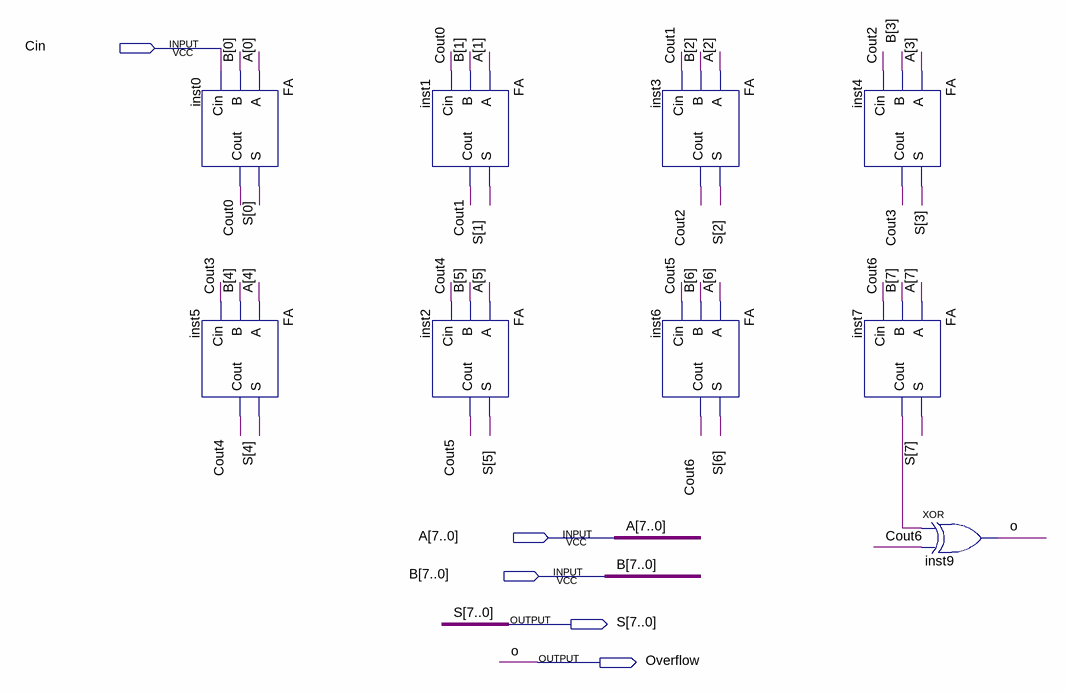
[diagram p0: schematic sheet]
// Quartus schematic Adder8bit.bdf as structural Verilog: 9 symbols, 5 pins
module Adder8bit (
  input  Cin,
  input  [7:0] A,
  input  [7:0] B,
  output [7:0] S,
  output Overflow
);

  wire Cout0, Cout1, Cout2, Cout3, Cout4, Cout5, Cout6, inst7_cout;

  FA inst0 (.A(A[0]), .B(B[0]), .Cin(Cin), .S(S[0]), .Cout(Cout0));
  FA inst5 (.A(A[4]), .B(B[4]), .Cin(Cout3), .S(S[4]), .Cout(Cout4));
  FA inst1 (.A(A[1]), .B(B[1]), .Cin(Cout0), .S(S[1]), .Cout(Cout1));
  FA inst2 (.A(A[5]), .B(B[5]), .Cin(Cout4), .S(S[5]), .Cout(Cout5));
  FA inst3 (.A(A[2]), .B(B[2]), .Cin(Cout1), .S(S[2]), .Cout(Cout2));
  FA inst6 (.A(A[6]), .B(B[6]), .Cin(Cout5), .S(S[6]), .Cout(Cout6));
  FA inst4 (.A(A[3]), .B(B[3]), .Cin(Cout2), .S(S[3]), .Cout(Cout3));
  FA inst7 (.A(A[7]), .B(B[7]), .Cin(Cout6), .S(S[7]), .Cout(inst7_cout));
  xor inst9 (Overflow, inst7_cout, Cout6);

  // Other names for the same wires on the sheet: o = Overflow
endmodule
